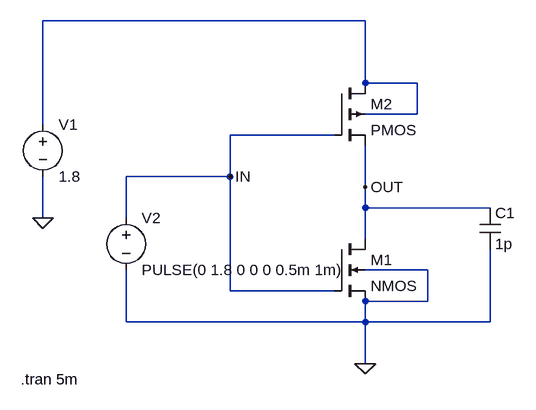
[diagram p0: schematic CMOS_inverter.asc]
CMOS_inverter.asc, the LTspice schematic file:
Version 4
SHEET 1 880 680
WIRE 272 -176 -224 -176
WIRE 272 -80 272 -176
WIRE 352 -80 272 -80
WIRE 272 -64 272 -80
WIRE 352 -32 352 -80
WIRE 352 -32 272 -32
WIRE -224 -16 -224 -176
WIRE 224 0 64 0
WIRE 64 64 64 0
WIRE 64 64 -96 64
WIRE 272 80 272 16
WIRE 272 112 272 80
WIRE 464 112 272 112
WIRE -224 128 -224 64
WIRE -96 128 -96 64
WIRE 272 160 272 112
WIRE 368 208 272 208
WIRE 64 240 64 64
WIRE 224 240 64 240
WIRE 368 256 368 208
WIRE 368 256 272 256
WIRE -96 288 -96 208
WIRE 272 288 272 256
WIRE 272 288 -96 288
WIRE 464 288 464 176
WIRE 464 288 272 288
WIRE 272 352 272 288
FLAG -224 128 0
FLAG 272 352 0
FLAG 64 64 IN
FLAG 272 80 OUT
SYMBOL nmos4 224 160 R0
SYMATTR InstName M1
SYMATTR Value2 l=180n w=10u
SYMBOL pmos4 224 -80 R0
SYMATTR InstName M2
SYMATTR Value2 l=180n w=50u
SYMBOL voltage -224 -32 R0
WINDOW 123 0 0 Left 0
WINDOW 39 0 0 Left 0
SYMATTR InstName V1
SYMATTR Value 1.8
SYMBOL voltage -96 112 R0
WINDOW 123 0 0 Left 0
WINDOW 39 0 0 Left 0
SYMATTR InstName V2
SYMATTR Value PULSE(0 1.8 0 0 0 0.5m 1m)
SYMBOL cap 448 112 R0
SYMATTR InstName C1
SYMATTR Value 1p
TEXT -258 376 Left 2 !.tran 5m

The netlist it stands for:
* CMOS_inverter.asc
M1 OUT IN 0 0 NMOS l=180n w=10u
M2 N001 IN OUT N001 PMOS l=180n w=50u
V1 N001 0 1.8
V2 IN 0 PULSE(0 1.8 0 0 0 0.5m 1m)
C1 OUT 0 1p
.model NMOS NMOS
.model PMOS PMOS
.lib standard.mos
.tran 5m
.backanno
.end